# EAGLE design toyotune_usb (EAGLE 5.11)

## Sheet 1 of 2
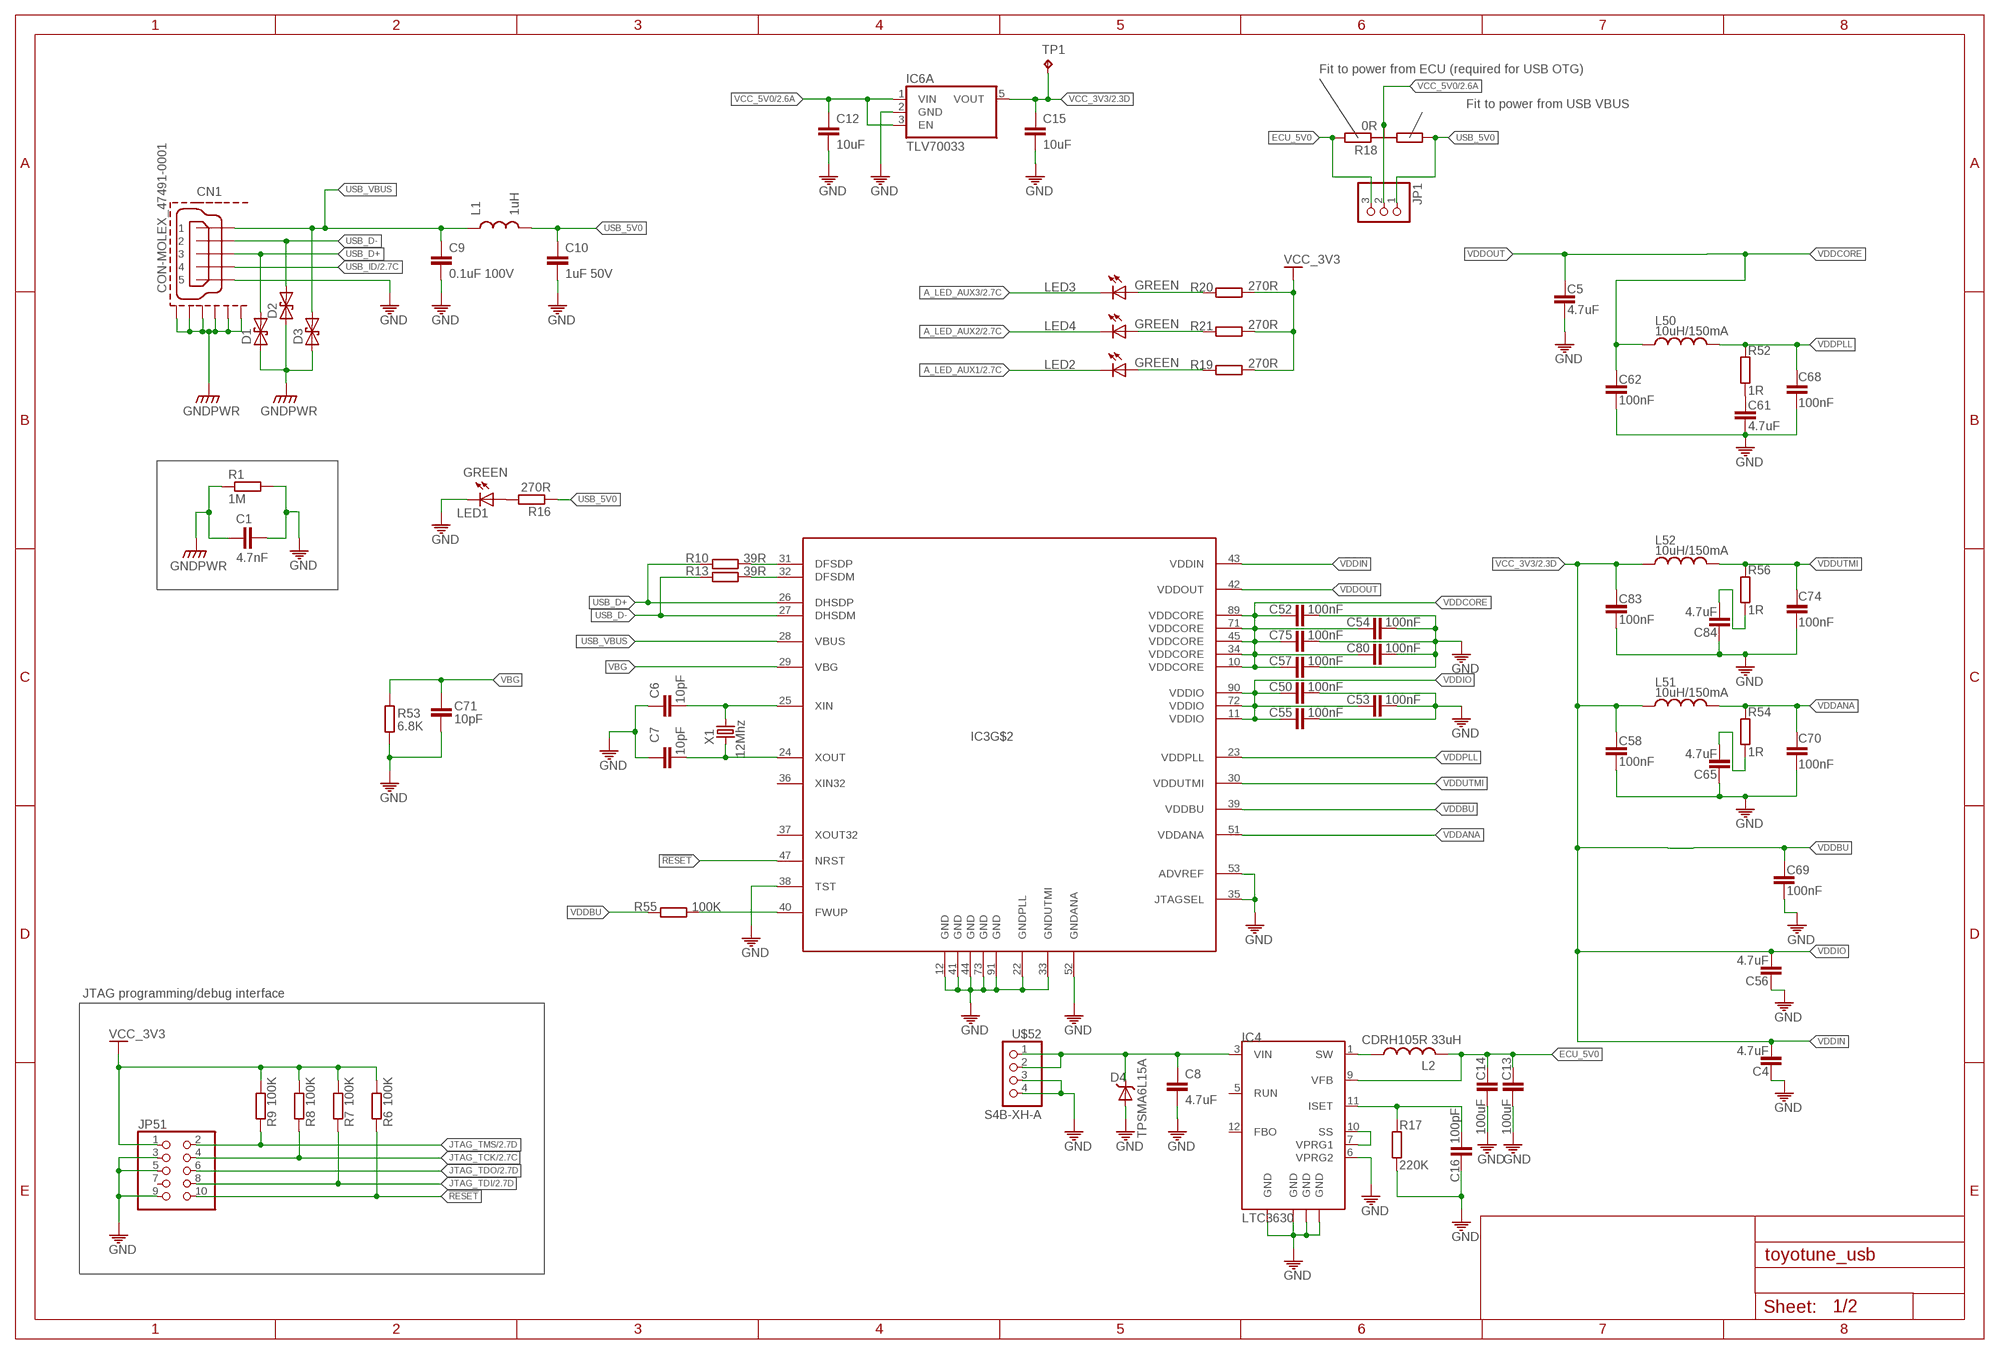
[diagram p0: schematic, sheet 1]

### Parts
C1  4.7nF  C-EUC0603  [C0603]
C4  4.7uF  C-EUC0805  [C0805]
C5  4.7uF  C-EUC0805  [C0805]
C6  10pF  C-EUC0603  [C0603]
C7  10pF  C-EUC0603  [C0603]
C8  4.7uF  C-EUC2220K  [C2220K]
C9  0.1uF 100V  C-EUC0603  [C0603]
C10  1uF 50V  C-EUC0603  [C0603]
C12  10uF  C-EUC0603  [C0603]
C13  100uF  C-EUC1210  [C1210]
C14  100uF  C-EUC1210  [C1210]
C15  10uF  C-EUC0603  [C0603]
C16  100pF  C-EUC0603  [C0603]
C50  100nF  C-EUC0603  [C0603]
C52  100nF  C-EUC0603  [C0603]
C53  100nF  C-EUC0603  [C0603]
C54  100nF  C-EUC0603  [C0603]
C55  100nF  C-EUC0603  [C0603]
C56  4.7uF  C-EUC0805  [C0805]
C57  100nF  C-EUC0603  [C0603]
C58  100nF  C-EUC0603  [C0603]
C61  4.7uF  C-EUC0805  [C0805]
C62  100nF  C-EUC0603  [C0603]
C65  4.7uF  C-EUC0805  [C0805]
C68  100nF  C-EUC0603  [C0603]
C69  100nF  C-EUC0603  [C0603]
C70  100nF  C-EUC0603  [C0603]
C71  10pF  C-EUC0603  [C0603]
C74  100nF  C-EUC0603  [C0603]
C75  100nF  C-EUC0603  [C0603]
C80  100nF  C-EUC0603  [C0603]
C83  100nF  C-EUC0603  [C0603]
C84  4.7uF  C-EUC0805  [C0805]
CN1  CON-MOLEX_47491-0001  [CON-MOLEX_47491-0001]
D1  PGB1010603  [R0603]
D2  PGB1010603  [R0603]
D3  PGB1010603  [R0603]
D4  TPSMA6L15A  TPSMA6L  [DO-221AC]
IC3  ATSAM3X4C  [LQFP100]
IC4  LTC3630  [MSE16]
IC6A  TLV70033  [DDC_R-PDSO-G5]
JP1  PINHD-1X3  [1X03]
JP51  PINHD-2X5/90  [2X05/90]
L1  1uH  INDUCTOR0603  [0603]
L2  CDRH105R 33uH  CDRH105R  [CDRH105R]
L50  10uH/150mA  NLFV25  [NLFV25]
L51  10uH/150mA  NLFV25  [NLFV25]
L52  10uH/150mA  NLFV25  [NLFV25]
LED1  GREEN  LEDCHIP-LED0603  [CHIP-LED0603]
LED2  GREEN  LEDCHIP-LED0603  [CHIP-LED0603]
LED3  GREEN  LEDCHIP-LED0603  [CHIP-LED0603]
LED4  GREEN  LEDCHIP-LED0603  [CHIP-LED0603]
R1  1M  R-EU_R0603  [R0603]
R6  100K  R-EU_R0603  [R0603]
R7  100K  R-EU_R0603  [R0603]
R8  100K  R-EU_R0603  [R0603]
R9  100K  R-EU_R0603  [R0603]
R10  39R  R-EU_R0603  [R0603]
R11  0R  NET_JOIN  [NET_JOIN]
R12  0R  NET_JOIN  [NET_JOIN]
R13  39R  R-EU_R0603  [R0603]
R14  0R  NET_JOIN  [NET_JOIN]
R16  270R  R-EU_R0603  [R0603]
R17  220K  R-EU_R0603  [R0603]
R18  0R  R-EU_D  [R0603-D]
R19  270R  R-EU_R0603  [R0603]
R20  270R  R-EU_R0603  [R0603]
R21  270R  R-EU_R0603  [R0603]
R51  0R  NET_JOIN  [NET_JOIN]
R52  1R  R-EU_R0603  [R0603]
R53  6.8K  R-EU_R0603  [R0603]
R54  1R  R-EU_R0603  [R0603]
R55  100K  R-EU_R0603  [R0603]
R56  1R  R-EU_R0603  [R0603]
TP1  TPPAD1-13  [P1-13]
U$52  S4B-XH-A  [JST-4]
X1  12Mhz  CRYSTAL5X3  [CRYSTAL-SMD-5X3]

### Nets
!RESET: IC3.47(NRST) JP51.10 R6.2
A_LED_AUX1: LED2.C ; also sheet 2
A_LED_AUX2: LED4.C ; also sheet 2
A_LED_AUX3: LED3.C ; also sheet 2
ECU_5V0: C13.1 C14.1 IC4.9(VFB) JP1.3 L2.2 R18.2
FWUP: IC3.40(FWUP) R55.1
GND: C1.2 C4.2 C5.1 C6.2 C7.2 C8.2 C9.2 C10.2 C12.2 C13.2 C14.2 C15.2 C16.1 C50.2 C52.2 C53.2 C54.2 C55.2 C56.2 C57.2 C58.1 C61.1 C62.1 C65.2 C68.1 C69.1 C70.1 C71.2 C74.1 C75.2 C80.2 C83.1 C84.2 CN1.5 D4.A IC3.12(GND) IC3.22(GNDPLL) IC3.33(GNDUTMI) IC3.35(JTAGSEL) IC3.38(TST) IC3.41(GND) IC3.44(GND) IC3.52(GNDANA) IC3.53(ADVREF) IC3.73(GND) IC3.91(GND) IC4.6(VPRG2) IC4.8(GND) IC4.14(GND) IC4.16(GND) IC4.17(GND) IC6A.2(GND) JP51.3 JP51.5 JP51.9 LED1.C R1.2 R17.2 R53.2 U$52.3 U$52.4 ; also sheet 2
GNDPWER: C1.1 CN1.GND@1(GND1) CN1.GND@2(GND2) CN1.GND@3(GND3) CN1.GND@4(GND4) CN1.GND@5(GND5) CN1.GND@6(GND6) D1.1 D2.1 D3.1 R1.1 ; supply symbol labelled GNDPWR
JTAG_TCK: JP51.4 R8.2 ; also sheet 2
JTAG_TDI: JP51.8 R7.2 ; also sheet 2
JTAG_TDO: JP51.6 ; also sheet 2
JTAG_TMS: JP51.2 R9.2 ; also sheet 2
N$1: IC4.7(VPRG1) IC4.10(SS)
N$2: LED1.A R16.2
N$3: IC3.32(DFSDM) R13.1
N$4: IC3.31(DFSDP) R10.1
N$8: LED3.A R20.2
N$9: LED4.A R21.2
N$13: IC4.1(SW) L2.1
N$14: LED2.A R19.2
N$17: C16.2 IC4.11(ISET) R17.1
N$18: C84.1 R56.2
N$19: C61.2 R52.2
N$20: C65.1 R54.2
USB_5V0: C10.1 JP1.1 L1.2 R16.1 R18.3
USB_D+: CN1.3 D1.2 IC3.26(DHSDP) R10.2
USB_D-: CN1.2 D2.2 IC3.27(DHSDM) R13.2
USB_ID: CN1.4 ; also sheet 2
USB_VBUS: C9.1 CN1.1 D3.2 IC3.28(VBUS) L1.1
VBG: C71.1 IC3.29(VBG) R53.1
VCC_3V3: C15.1 C58.2 C83.2 IC6A.5(VOUT) JP51.1 L51.1 L52.1 R6.1 R7.1 R8.1 R9.1 R11.P$1 R12.P$1 R19.1 R20.1 R21.1 R51.P$1 TP1.TP ; also sheet 2
VCC_5V0: C12.1 IC6A.1(VIN) IC6A.3(EN) JP1.2 R18.1 ; also sheet 2
VDDANA: C70.2 IC3.51(VDDANA) L51.2 R54.1
VDDBU: C69.2 IC3.39(VDDBU) R11.P$2 R55.2
VDDCORE: C52.1 C54.1 C57.1 C62.2 C75.1 C80.1 IC3.10(VDDCORE) IC3.34(VDDCORE) IC3.45(VDDCORE) IC3.71(VDDCORE) IC3.89(VDDCORE) L50.1 R14.P$2
VDDIN: C4.1 IC3.43(VDDIN) R12.P$2
VDDIO: C50.1 C53.1 C55.1 C56.1 IC3.11(VDDIO) IC3.72(VDDIO) IC3.90(VDDIO) R51.P$2
VDDOUT: C5.2 IC3.42(VDDOUT) R14.P$1
VDDPLL: C68.2 IC3.23(VDDPLL) L50.2 R52.1
VDDUTMI: C74.2 IC3.30(VDDUTMI) L52.2 R56.1
VIN: C8.1 D4.C IC4.3(VIN) U$52.1 U$52.2
XIN: C7.1 IC3.24(XOUT) X1.3
XOUT: C6.1 IC3.25(XIN) X1.1
Unconnected: IC3.36(XIN32) IC3.37(XOUT32) IC4.5(RUN) IC4.12(FBO) JP51.7

### Notes on the sheet
- Fit to power from ECU (required for USB OTG)
- Fit to power from USB VBUS
- JTAG programming/debug interface

## Sheet 2 of 2
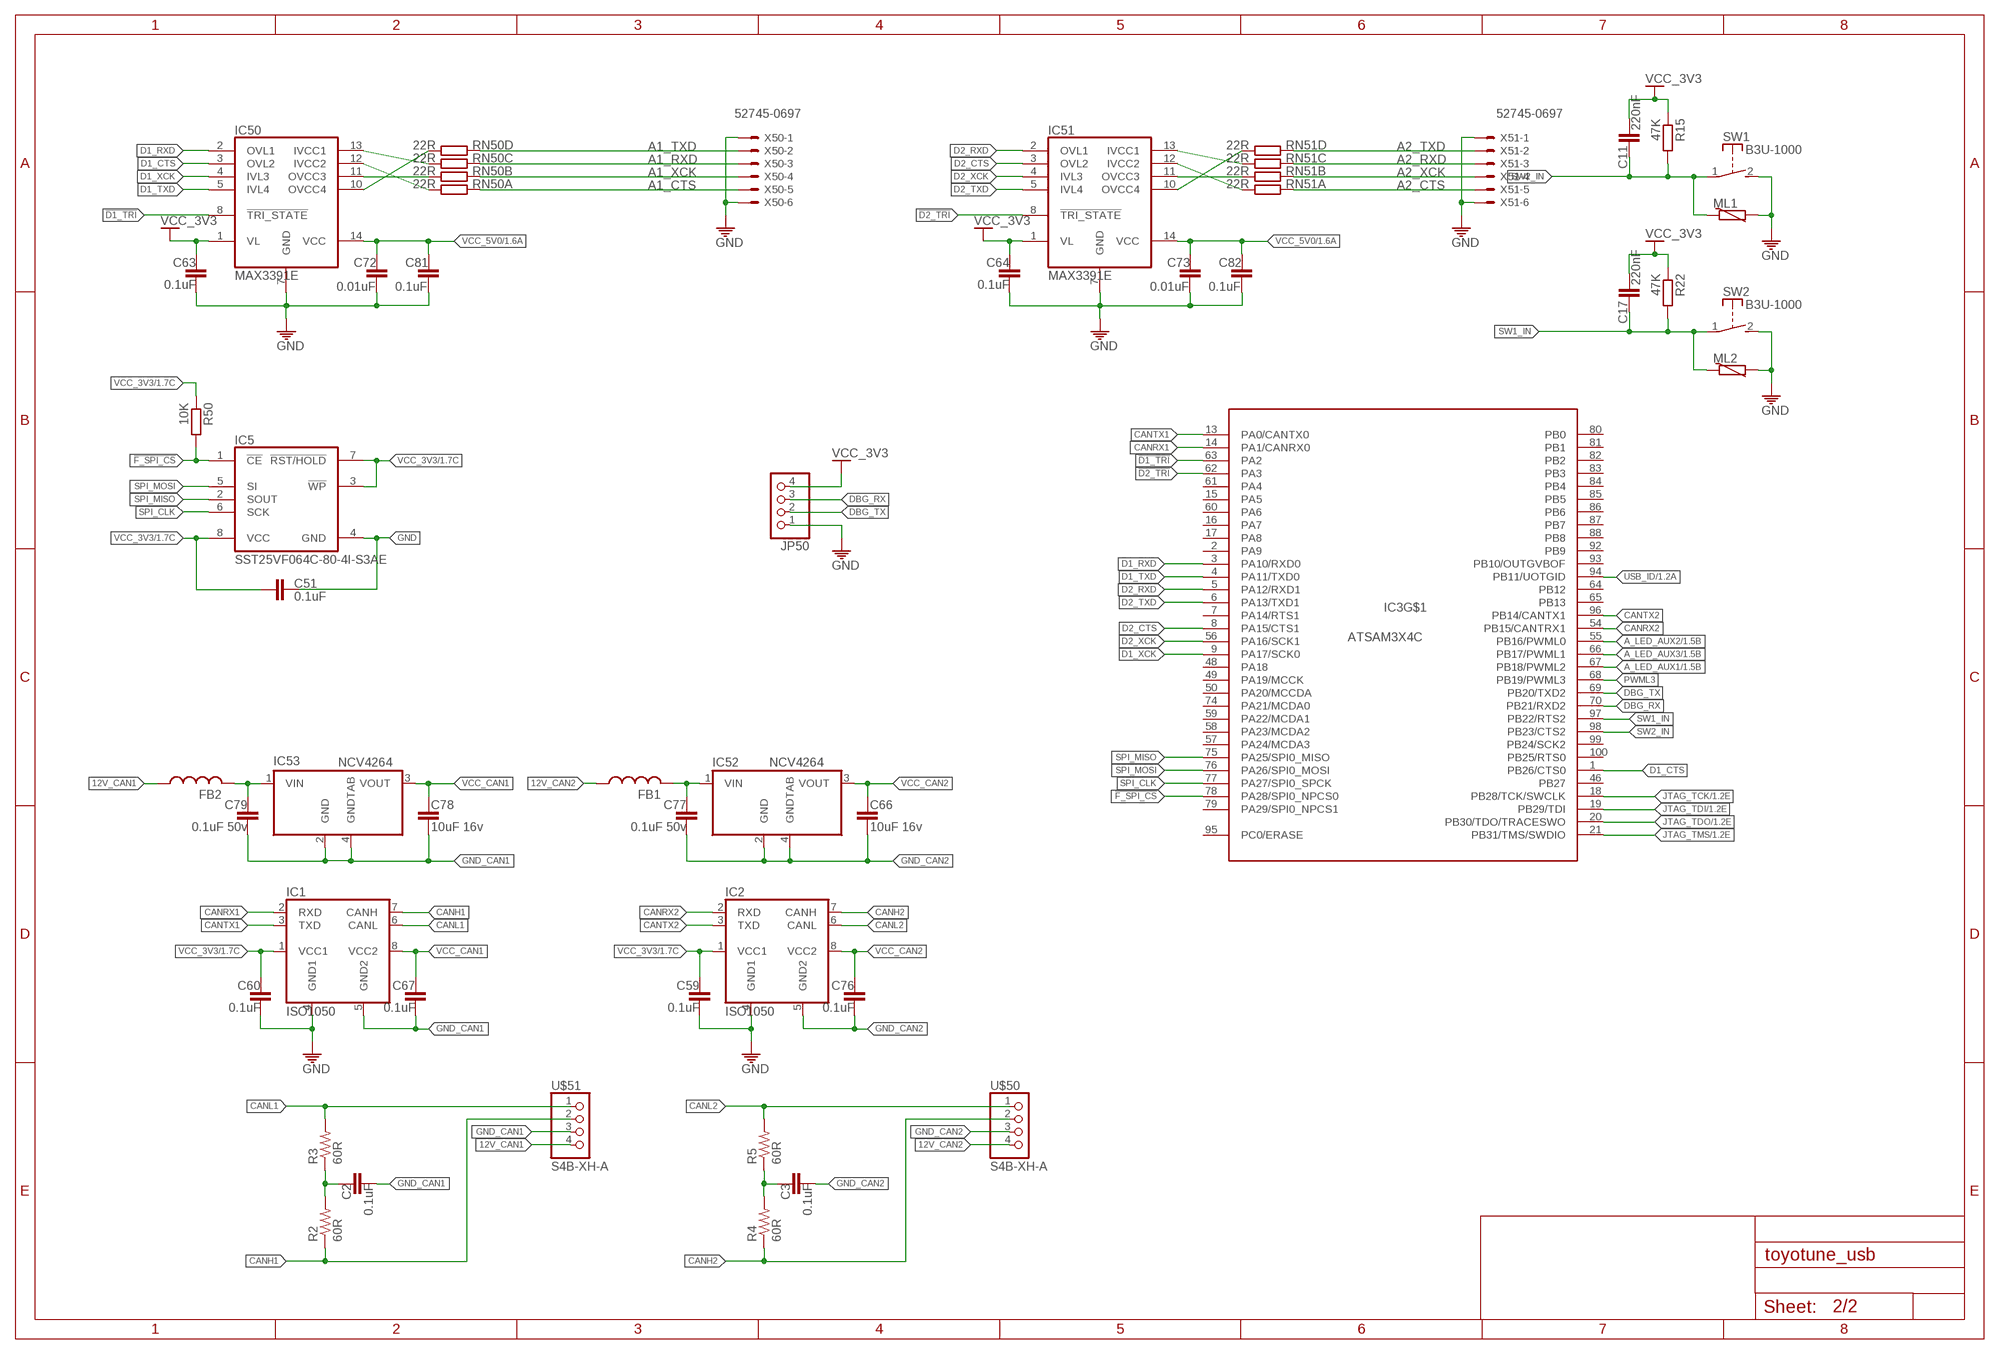
[diagram p1: schematic, sheet 2]

### Parts
C2  0.1uF  C-EUC0603  [C0603]
C3  0.1uF  C-EUC0603  [C0603]
C11  220nF  C-EUC0603  [C0603]
C17  220nF  C-EUC0603  [C0603]
C51  0.1uF  C-EUC0603  [C0603]
C59  0.1uF  C-EUC0603  [C0603]
C60  0.1uF  C-EUC0603  [C0603]
C63  0.1uF  C-EUC0603  [C0603]
C64  0.1uF  C-EUC0603  [C0603]
C66  10uF 16v  C-EUC0603  [C0603]
C67  0.1uF  C-EUC0603  [C0603]
C72  0.01uF  C-EUC0603  [C0603]
C73  0.01uF  C-EUC0603  [C0603]
C76  0.1uF  C-EUC0603  [C0603]
C77  0.1uF 50v  C-EUC0603  [C0603]
C78  10uF 16v  C-EUC0603  [C0603]
C79  0.1uF 50v  C-EUC0603  [C0603]
C81  0.1uF  C-EUC0603  [C0603]
C82  0.1uF  C-EUC0603  [C0603]
FB1  MI0805K400R  [R0805]
FB2  MI0805K400R  [R0805]
IC1  ISO1050  [DUB_R-PDSO-G8]
IC2  ISO1050  [DUB_R-PDSO-G8]
IC5  SST25VF064C-80-4I-S3AE  [SOIC8-200]
IC50  MAX3391E  [TSSOP14]
IC51  MAX3391E  [TSSOP14]
IC52  NCV4264  [SOT223-R]
IC53  NCV4264  [SOT223-R]
JP50  PINHD-1X4  [1X04]
ML1  V5.5MLA0603NH  [R0603]
ML2  V5.5MLA0603NH  [R0603]
R2  60R  R-US_MELF0207R  [MINI_MELF-0207R]
R3  60R  R-US_MELF0207R  [MINI_MELF-0207R]
R4  60R  R-US_MELF0207R  [MINI_MELF-0207R]
R5  60R  R-US_MELF0207R  [MINI_MELF-0207R]
R15  47K  R-EU_R0603  [R0603]
R22  47K  R-EU_R0603  [R0603]
R50  10K  R-EU_R0603  [R0603]
RN50  22R  CAT16-J4  [CAT16-J4]
RN51  22R  CAT16-J4  [CAT16-J4]
SW1  B3U-1000  [B3U-1000]
SW2  B3U-1000  [B3U-1000]
U$50  S4B-XH-A  [JST-4]
U$51  S4B-XH-A  [JST-4]
X50  52745-0697  [52745-0690]
X51  52745-0697  [52745-0690]

### Nets
12V_CAN1: FB2.1 U$51.4
12V_CAN2: FB1.1 U$50.4
!D1_TRI: IC3.63(PA2) IC50.8(!TRI_STATE)
!D2_TRI: IC3.62(PA3) IC51.8(!TRI_STATE)
!F_SPI_CS: IC3.78(PA28/SPI0_NPCS0) IC5.1(!CE) R50.2
A1_CTS: RN50.8 X50.5
A1_RXD: RN50.6 X50.3
A1_TXD: RN50.5 X50.2
A1_XCK: RN50.7 X50.4
A2_CTS: RN51.8 X51.5
A2_RXD: RN51.6 X51.3
A2_TXD: RN51.5 X51.2
A2_XCK: RN51.7 X51.4
A_LED_AUX1: IC3.67(PB18/PWML2) ; also sheet 1
A_LED_AUX2: IC3.55(PB16/PWML0) ; also sheet 1
A_LED_AUX3: IC3.66(PB17/PWML1) ; also sheet 1
CANH1: IC1.7(CANH) R2.1 U$51.2
CANH2: IC2.7(CANH) R4.1 U$50.2
CANL1: IC1.6(CANL) R3.2 U$51.1
CANL2: IC2.6(CANL) R5.2 U$50.1
CANRX1: IC1.2(RXD) IC3.14(PA1/CANRX0)
CANRX2: IC2.2(RXD) IC3.54(PB15/CANTRX1)
CANTX1: IC1.3(TXD) IC3.13(PA0/CANTX0)
CANTX2: IC2.3(TXD) IC3.96(PB14/CANTX1)
D1_CTS: IC3.1(PB26/CTS0) IC50.3(OVL2)
D1_RXD: IC3.3(PA10/RXD0) IC50.2(OVL1)
D1_TXD: IC3.4(PA11/TXD0) IC50.5(IVL4)
D1_XCK: IC3.9(PA17/SCK0) IC50.4(IVL3)
D2_CTS: IC3.8(PA15/CTS1) IC51.3(OVL2)
D2_RXD: IC3.5(PA12/RXD1) IC51.2(OVL1)
D2_TXD: IC3.6(PA13/TXD1) IC51.5(IVL4)
D2_XCK: IC3.56(PA16/SCK1) IC51.4(IVL3)
DBG_RX: IC3.70(PB21/RXD2) JP50.3
DBG_TX: IC3.69(PB20/TXD2) JP50.2
GND: C51.2 C59.1 C60.1 C63.1 C64.1 C72.1 C73.1 C81.1 C82.1 IC1.4(GND1) IC2.4(GND1) IC5.4(GND) IC50.7(GND) IC51.7(GND) JP50.1 ML1.2 ML2.2 SW1.2(S) SW2.2(S) X50.1 X50.6 X51.1 X51.6 ; also sheet 1
GND_CAN1: C2.1 C67.1 C78.1 C79.1 IC1.5(GND2) IC53.2(GND) IC53.4(GNDTAB) U$51.3
GND_CAN2: C3.1 C66.1 C76.1 C77.1 IC2.5(GND2) IC52.2(GND) IC52.4(GNDTAB) U$50.3
JTAG_TCK: IC3.18(PB28/TCK/SWCLK) ; also sheet 1
JTAG_TDI: IC3.19(PB29/TDI) ; also sheet 1
JTAG_TDO: IC3.20(PB30/TDO/TRACESWO) ; also sheet 1
JTAG_TMS: IC3.21(PB31/TMS/SWDIO) ; also sheet 1
N$5: IC50.13(IVCC1) RN50.3
N$6: IC51.13(IVCC1) RN51.3
N$7: IC51.12(IVCC2) RN51.1
N$10: IC50.12(IVCC2) RN50.1
N$11: IC51.10(OVCC4) RN51.4
N$12: IC50.11(OVCC3) RN50.2
N$15: IC50.10(OVCC4) RN50.4
N$16: IC51.11(OVCC3) RN51.2
N$23: C3.2 R4.2 R5.1
N$30: C2.2 R2.2 R3.1
N$55: C79.2 FB2.2 IC53.1(VIN)
N$90: C77.2 FB1.2 IC52.1(VIN)
PWML3: IC3.68(PB19/PWML3)
SPI_CLK: IC3.77(PA27/SPI0_SPCK) IC5.6(SCK)
SPI_MISO: IC3.75(PA25/SPI0_MISO) IC5.2(SOUT)
SPI_MOSI: IC3.76(PA26/SPI0_MOSI) IC5.5(SI)
SW1_IN: C17.2 IC3.97(PB22/RTS2) ML2.1 R22.2 SW2.1(P)
SW2_IN: C11.2 IC3.98(PB23/CTS2) ML1.1 R15.2 SW1.1(P)
USB_ID: IC3.94(PB11/UOTGID) ; also sheet 1
VCC_3V3: C11.1 C17.1 C51.1 C59.2 C60.2 C63.2 C64.2 IC1.1(VCC1) IC2.1(VCC1) IC5.3(!WP) IC5.7(!RST/HOLD) IC5.8(VCC) IC50.1(VL) IC51.1(VL) JP50.4 R15.1 R22.1 R50.1 ; also sheet 1
VCC_5V0: C72.2 C73.2 C81.2 C82.2 IC50.14(VCC) IC51.14(VCC) ; also sheet 1
VCC_CAN1: C67.2 C78.2 IC1.8(VCC2) IC53.3(VOUT)
VCC_CAN2: C66.2 C76.2 IC2.8(VCC2) IC52.3(VOUT)
Unconnected: IC3.2(PA9) IC3.7(PA14/RTS1) IC3.15(PA5) IC3.16(PA7) IC3.17(PA8) IC3.46(PB27) IC3.48(PA18) IC3.49(PA19/MCCK) IC3.50(PA20/MCCDA) IC3.57(PA24/MCDA3) IC3.58(PA23/MCDA2) IC3.59(PA22/MCDA1) IC3.60(PA6) IC3.61(PA4) IC3.64(PB12) IC3.65(PB13) IC3.74(PA21/MCDA0) IC3.79(PA29/SPI0_NPCS1) IC3.80(PB0) IC3.81(PB1) IC3.82(PB2) IC3.83(PB3) IC3.84(PB4) IC3.85(PB5) IC3.86(PB6) IC3.87(PB7) IC3.88(PB8) IC3.92(PB9) IC3.93(PB10/OUTGVBOF) IC3.95(PC0/ERASE) IC3.99(PB24/SCK2) IC3.100(PB25/RTS0)

## Library data of the parts
C1-C3 C6 C7 C11 C16 C17 C50-C55 C57-C60 C62-C64 C66-C83 = rcl:C-EU: CAPACITOR, European symbol
C4 C5 C8-C10 C12-C15 C56 C61 C65 C84 = toyotune:C-EU: CAPACITOR, European symbol
CN1 = toyotune:CON-MOLEX_47491-0001
D1-D3 = toyotune:PGB1010603
D4 = toyotune:TPSMA6L
FB1 FB2 = toyotune:MI0805K400R
IC1 IC2 = toyotune:ISO1050
IC3 = toyotune:ATSAM3X4C
IC4 = toyotune:LTC3630
IC5 = toyotune:SST25VF064C-80-4I
IC6A = toyotune:TLV70033
IC50 IC51 = toyotune:MAX3391E
IC52 IC53 = toyotune:NCV4264
JP1 = pinhead:PINHD-1X3: PIN HEADER
JP50 = toyotune:PINHD-1X4: PIN HEADER
JP51 = toyotune:PINHD-2X5: PIN HEADER
L1 = toyotune:INDUCTOR: Inductors Basic Inductor/Choke - 0603 and 1206. Footprints are not proven and vary greatly between part numbers.
L2 = toyotune:CDRH105R
L50-L52 = toyotune:NLFV25
LED1 = led:LED: LED OSRAM: - CHIPLED LG R971, LG N971, LY N971, LG Q971, LY Q971, LO R971, LY R971 LH N974, LH R974 LS Q976, LO Q976, LY Q976 LO Q996 - Hyper CHIPLED LW Q18S LB Q993, LB Q99A, LB R99A - SideLED LS A670, LO A670, LY A670, LG A670, LP A670 LB A673, LV A673, LT A673, LW A673 LH A674 LY A675 LS A676, LA A676, LO A676, LY A676, LW A676 LS A679, LY A679, LG A679 - Hyper Micro SIDELED® LS Y876, LA Y876, LO Y876, LY Y876 LT Y87S - SmartLED LW L88C, LW L88S LB L89C, LB L89S, LG L890 LS L89K, LO L89K, LY L89K LS L896, LA L896, LO L896, LY L896 - TOPLED LS T670, LO T670, LY T670, LG T670, LP T670 LSG T670, LSP T670, LSY T670, LOP T670, LYG T670 LG T671, LOG T671, LSG T671 LB T673, LV T673, LT T673, LW T673 LH T674 LS T676, LA T676, LO T676, LY T676, LB T676, LH T676, LSB T676, LW T676 LB T67C, LV T67C, LT T67C, LS T67K, LO T67K, LY T67K, LW E67C LS E67B, LA E67B, LO E67B, LY E67B, LB E67C, LV E67C, LT E67C LW T67C LS T679, LY T679, LG T679 LS T770, LO T770, LY T770, LG T770, LP T770 LB T773, LV T773, LT T773, LW T773 LH T774 LS E675, LA E675, LY E675, LS T675 LS T776, LA T776, LO T776, LY T776, LB T776 LHGB T686 LT T68C, LB T68C - Hyper Mini TOPLED® LB M676 - Mini TOPLED Santana® LG M470 LS M47K, LO M47K, LY M47K Source: http://www.osram.convergy.de LUXEON: - LUMILED® LXK2-PW12-R00, LXK2-PW12-S00, LXK2-PW14-U00, LXK2-PW14-V00 LXK2-PM12-R00, LXK2-PM12-S00, LXK2-PM14-U00 LXK2-PE12-Q00, LXK2-PE12-R00, LXK2-PE12-S00, LXK2-PE14-T00, LXK2-PE14-U00 LXK2-PB12-K00, LXK2-PB12-L00, LXK2-PB12-M00, LXK2-PB14-N00, LXK2-PB14-P00, LXK2-PB14-Q00 LXK2-PR12-L00, LXK2-PR12-M00, LXK2-PR14-Q00, LXK2-PR14-R00 LXK2-PD12-Q00, LXK2-PD12-R00, LXK2-PD12-S00 LXK2-PH12-R00, LXK2-PH12-S00 LXK2-PL12-P00, LXK2-PL12-Q00, LXK2-PL12-R00 Source: www.luxeon.com KINGBRIGHT: KA-3528ASYC Source: www.kingbright.com
LED2-LED4 = toyotune:LED: LED OSRAM: - CHIPLED LG R971, LG N971, LY N971, LG Q971, LY Q971, LO R971, LY R971 LH N974, LH R974 LS Q976, LO Q976, LY Q976 LO Q996 - Hyper CHIPLED LW Q18S LB Q993, LB Q99A, LB R99A - SideLED LS A670, LO A670, LY A670, LG A670, LP A670 LB A673, LV A673, LT A673, LW A673 LH A674 LY A675 LS A676, LA A676, LO A676, LY A676, LW A676 LS A679, LY A679, LG A679 - Hyper Micro SIDELED® LS Y876, LA Y876, LO Y876, LY Y876 LT Y87S - SmartLED LW L88C, LW L88S LB L89C, LB L89S, LG L890 LS L89K, LO L89K, LY L89K LS L896, LA L896, LO L896, LY L896 - TOPLED LS T670, LO T670, LY T670, LG T670, LP T670 LSG T670, LSP T670, LSY T670, LOP T670, LYG T670 LG T671, LOG T671, LSG T671 LB T673, LV T673, LT T673, LW T673 LH T674 LS T676, LA T676, LO T676, LY T676, LB T676, LH T676, LSB T676, LW T676 LB T67C, LV T67C, LT T67C, LS T67K, LO T67K, LY T67K, LW E67C LS E67B, LA E67B, LO E67B, LY E67B, LB E67C, LV E67C, LT E67C LW T67C LS T679, LY T679, LG T679 LS T770, LO T770, LY T770, LG T770, LP T770 LB T773, LV T773, LT T773, LW T773 LH T774 LS E675, LA E675, LY E675, LS T675 LS T776, LA T776, LO T776, LY T776, LB T776 LHGB T686 LT T68C, LB T68C - Hyper Mini TOPLED® LB M676 - Mini TOPLED Santana® LG M470 LS M47K, LO M47K, LY M47K Source: http://www.osram.convergy.de LUXEON: - LUMILED® LXK2-PW12-R00, LXK2-PW12-S00, LXK2-PW14-U00, LXK2-PW14-V00 LXK2-PM12-R00, LXK2-PM12-S00, LXK2-PM14-U00 LXK2-PE12-Q00, LXK2-PE12-R00, LXK2-PE12-S00, LXK2-PE14-T00, LXK2-PE14-U00 LXK2-PB12-K00, LXK2-PB12-L00, LXK2-PB12-M00, LXK2-PB14-N00, LXK2-PB14-P00, LXK2-PB14-Q00 LXK2-PR12-L00, LXK2-PR12-M00, LXK2-PR14-Q00, LXK2-PR14-R00 LXK2-PD12-Q00, LXK2-PD12-R00, LXK2-PD12-S00 LXK2-PH12-R00, LXK2-PH12-S00 LXK2-PL12-P00, LXK2-PL12-Q00, LXK2-PL12-R00 Source: www.luxeon.com KINGBRIGHT: KA-3528ASYC Source: www.kingbright.com
ML1 ML2 = toyotune:V5.5MLA0603NH
R1 R6-R10 R13 R15-R17 R19-R22 R50 R52-R56 = rcl:R-EU_: RESISTOR, European symbol
R2-R5 = rcl:R-US_: RESISTOR, American symbol
R11 R12 R14 R51 = toyotune:NET_JOIN
R18 = toyotune:R-EU_D
RN50 RN51 = toyotune:CAT16-J4
SW1 SW2 = toyotune:B3U-1000
TP1 = testpad:TP: Test pad
U$50-U$52 = toyotune:S4B-XH-A
X1 = toyotune:CRYSTAL: Crystals Various standard crystals. Proven footprints. Spark Fun Electronics SKU : COM-00534
X50 X51 = toyotune:52745-0697: FFC/FPC-to-Board 0.50mm (.020") SMT Top Contact Right Angle, ZIF, Style Receptacle 52745 / 52435 Source: http://www.molex.com/product/ffc/52745.html; MPN: 52745-0690; OC_FARNELL: unknown; OC_NEWARK: 92M6374

## Net classes
0 default: width 0.152 mm, drill 0.33 mm, clearance 0.152 mm
1 power: width 0.01 mm, clearance 0.229 mm
2 usb: width 0.457 mm, drill 0.457 mm, clearance 0.152 mm

## Board
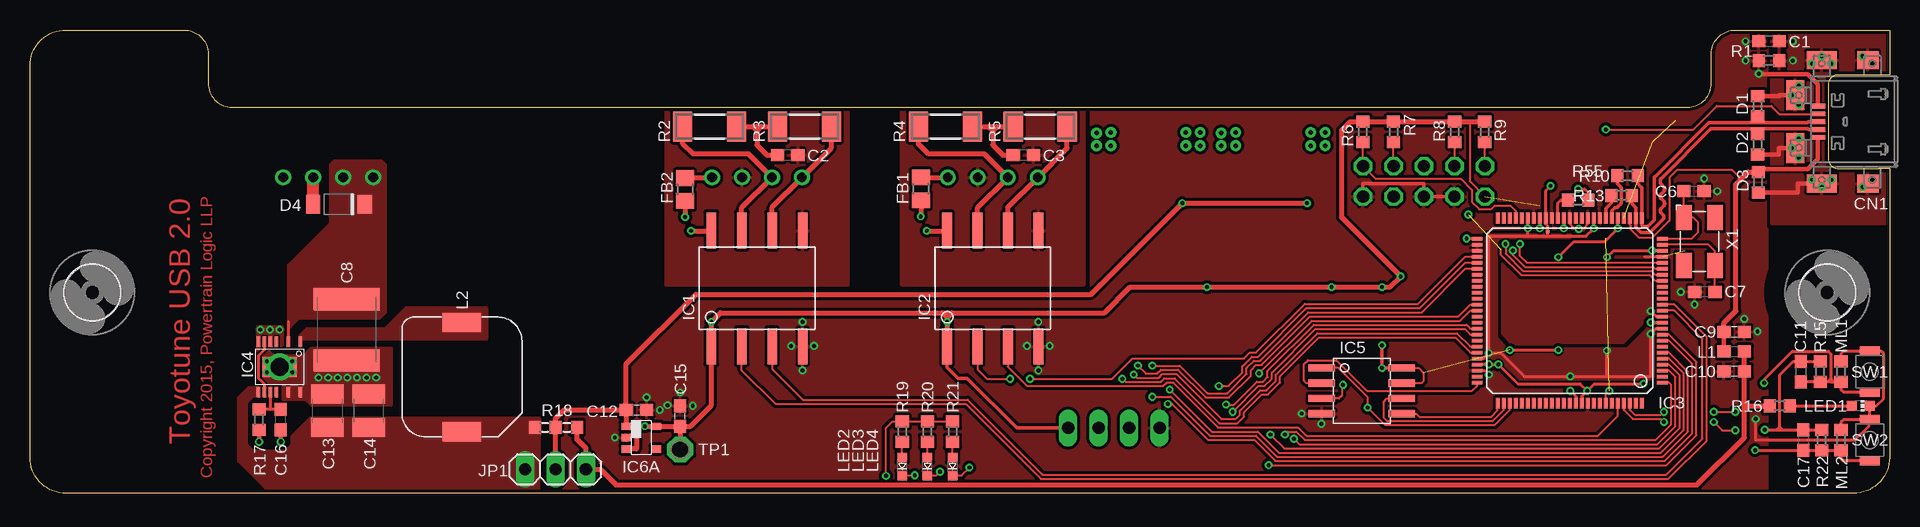
[diagram p2: board, top side]
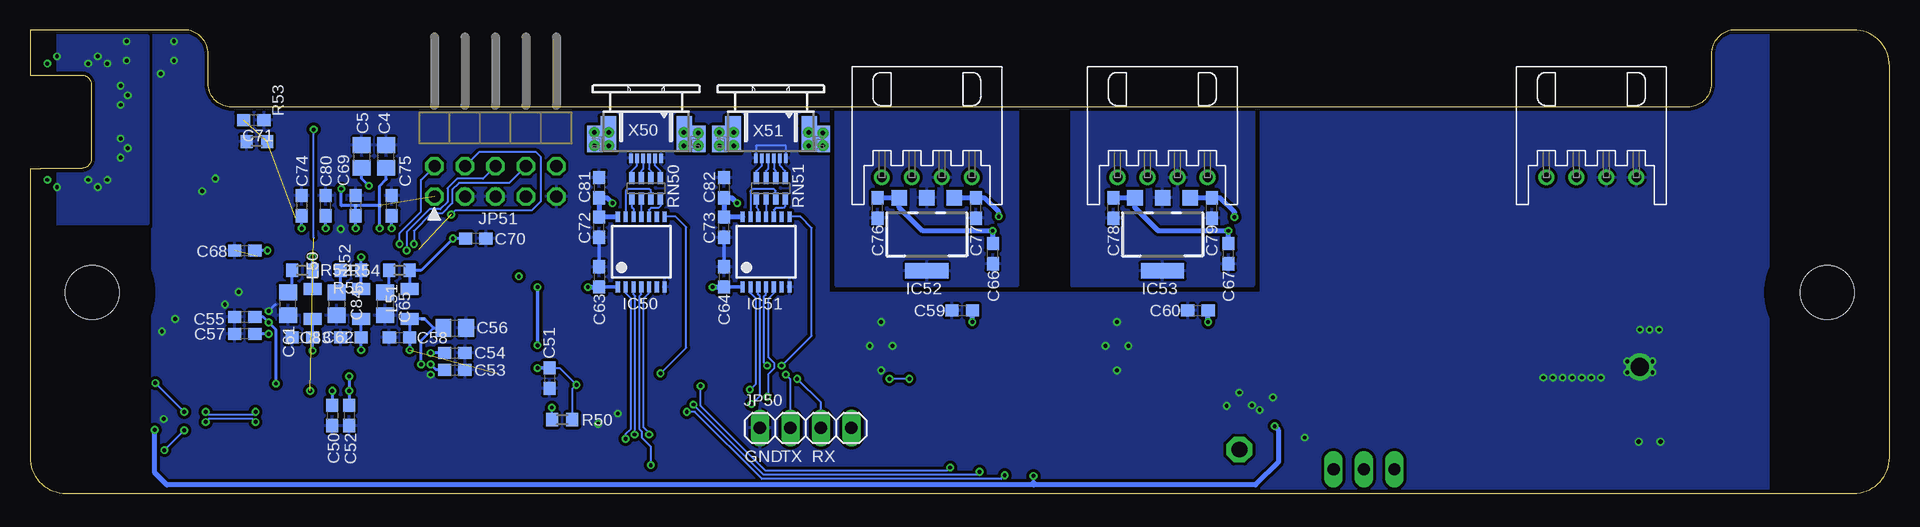
[diagram p3: board, bottom side, seen from below]

Size 155 x 38.65 mm. Coordinates in mm from the lower left corner, seen from the top.
Outline: 154.05,34.9 155,34.9 155,38.65 142.15,38.65 arc90 140.15,36.65 140.15,34.2 arc-90 138.15,32.2 16.85,32.2 arc-90 14.85,34.2 14.85,36.65 arc90 12.85,38.65 3,38.65 arc90 0,35.65 0,3 arc90 3,0 152,0 arc90 155,3 155,27.1 154.1,27.1
Copper layers (1*16): Top 0.035mm / dielectric 1.5mm / Bottom 0.035mm
Design rules "elecrow *": minimum track width 6mil, minimum drill 12mil, track to track 6mil, track to pad 6mil, pad to pad 6mil, via to via 6mil, smd to smd 0mil, copper to edge 10mil, drill to drill 10mil, minimum pad ring 10mil, minimum via ring 6mil, stop-mask expansion 2mil, vias tented up to drill 100mil, thermal gap 8mil
bRestrict: area 152.8,-0.1 to 154.8,40.1

### Footprints (pad centres in the part's own frame; a part is rotated, then mirrored left to right if it is on the bottom)
C0603 = smd 1.1 x 1: 1 -0.85,0; 2 0.85,0
C0805 = smd 1.3 x 1.5: 1 -0.95,0; 2 0.95,0
C2220K = smd 1.85 x 5.5: 1 -2.55,0; 2 2.55,0
C1210 = smd 1.6 x 2.7: 1 -1.4,0; 2 1.4,0
CON-MOLEX_47491-0001 = smd 1.25 x 0.4: 1 2.475,1.3; 2 2.475,0.65; 3 2.475,0; 4 2.475,-0.65; 5 2.475,-1.3 | smd 1.8 x 1.5: GND@1 -1.7,5.15; GND@6 -1.7,-5.15 | smd 2.5 x 1.5: GND@2 2.15,5.15; GND@5 2.15,-5.15 | smd 1.5 x 2.5: GND@3 4.35,2.2; GND@4 4.35,-2.2
R0603 = smd 1 x 1.1: 1 -0.85,0; 2 0.85,0
DO-221AC = smd 1.2 x 1.52: A -2.15,0; C 2.15,0
4.5 = hole 4.5: 0,0
R0805 = smd 1.3 x 1.5: 1 -0.95,0; 2 0.95,0
DUB_R-PDSO-G8 = smd 0.8 x 3: 1 -3.81,-4.826; 2 -1.27,-4.826; 3 1.27,-4.826; 4 3.81,-4.826; 5 3.81,4.826; 6 1.27,4.826; 7 -1.27,4.826; 8 -3.81,4.826
LQFP100 = smd 0.9 x 0.3: 1 -7.72,6; 2 -7.72,5.5; 3 -7.72,5; 4 -7.72,4.5; 5 -7.72,4; 6 -7.72,3.5; 7 -7.72,3; 8 -7.72,2.5; 9 -7.72,2; 10 -7.72,1.5; 11 -7.72,1; 12 -7.72,0.5; 13 -7.72,0; 14 -7.72,-0.5; 15 -7.72,-1; 16 -7.72,-1.5; 17 -7.72,-2; 18 -7.72,-2.5; 19 -7.72,-3; 20 -7.72,-3.5; 21 -7.72,-4; 22 -7.72,-4.5; 23 -7.72,-5; 24 -7.72,-5.5; 25 -7.72,-6; 51 7.72,-6; 52 7.72,-5.5; 53 7.72,-5; 54 7.72,-4.5; 55 7.72,-4; 56 7.72,-3.5; 57 7.72,-3; 58 7.72,-2.5; 59 7.72,-2; 60 7.72,-1.5; 61 7.72,-1; 62 7.72,-0.5; 63 7.72,0; 64 7.72,0.5; 65 7.72,1; 66 7.72,1.5; 67 7.72,2; 68 7.72,2.5; 69 7.72,3; 70 7.72,3.5; 71 7.72,4; 72 7.72,4.5; 73 7.72,5; 74 7.72,5.5; 75 7.72,6 | smd 0.3 x 0.9: 26 -6,-7.72; 27 -5.5,-7.72; 28 -5,-7.72; 29 -4.5,-7.72; 30 -4,-7.72; 31 -3.5,-7.72; 32 -3,-7.72; 33 -2.5,-7.72; 34 -2,-7.72; 35 -1.5,-7.72; 36 -1,-7.72; 37 -0.5,-7.72; 38 0,-7.72; 39 0.5,-7.72; 40 1,-7.72; 41 1.5,-7.72; 42 2,-7.72; 43 2.5,-7.72; 44 3,-7.72; 45 3.5,-7.72; 46 4,-7.72; 47 4.5,-7.72; 48 5,-7.72; 49 5.5,-7.72; 50 6,-7.72; 76 6,7.72; 77 5.5,7.72; 78 5,7.72; 79 4.5,7.72; 80 4,7.72; 81 3.5,7.72; 82 3,7.72; 83 2.5,7.72; 84 2,7.72; 85 1.5,7.72; 86 1,7.72; 87 0.5,7.72; 88 0,7.72; 89 -0.5,7.72; 90 -1,7.72; 91 -1.5,7.72; 92 -2,7.72; 93 -2.5,7.72; 94 -3,7.72; 95 -3.5,7.72; 96 -4,7.72; 97 -4.5,7.72; 98 -5,7.72; 99 -5.5,7.72; 100 -6,7.72
MSE16 = smd 0.305 x 0.89: 1 -1.75,-2.1; 3 -0.75,-2.1; 5 0.25,-2.1; 6 0.75,-2.1; 7 1.25,-2.1; 8 1.75,-2.1; 9 1.75,2.1; 10 1.25,2.1; 11 0.75,2.1; 12 0.25,2.1; 14 -0.75,2.1; 16 -1.75,2.1 | smd 2.845 x 1.651: 17 0,0
SOIC8-200 = smd 0.6 x 2.2: 1 -1.905,-3.175; 2 -0.635,-3.175; 3 0.635,-3.175; 4 1.905,-3.175; 5 1.905,3.493; 6 0.635,3.493; 7 -0.635,3.493; 8 -1.905,3.493
DDC_R-PDSO-G5 = smd 0.6 x 0.8: 1 -0.95,-1.25; 2 0,-1.25; 3 0.95,-1.25; 4 0.95,1.25; 5 -0.95,1.25
TSSOP14 = smd 0.35 x 0.9: 1 -1.95,-2.925; 2 -1.3,-2.925; 3 -0.65,-2.925; 4 0,-2.925; 5 0.65,-2.925; 6 1.3,-2.925; 7 1.95,-2.925; 8 1.95,2.925; 9 1.3,2.925; 10 0.65,2.925; 11 0,2.925; 12 -0.65,2.925; 13 -1.3,2.925; 14 -1.95,2.925
SOT223-R = smd 1.3 x 1.3: 1 -2.3,-3.05; 2 0,-3.05; 3 2.3,-3.05 | smd 3.6 x 1.3: 4 0,3.05
1X03 = drill 1.016 long: 1 -2.54,0; 2 0,0; 3 2.54,0
1X04 = drill 1.016 long: 1 -3.81,0; 2 -1.27,0; 3 1.27,0; 4 3.81,0
2X05/90 = drill 1.016 octagon: 1 -5.08,-6.35; 2 -5.08,-3.81; 3 -2.54,-6.35; 4 -2.54,-3.81; 5 0,-6.35; 6 0,-3.81; 7 2.54,-6.35; 8 2.54,-3.81; 9 5.08,-6.35; 10 5.08,-3.81
0603 = smd 1.1 x 1: 1 -0.85,0; 2 0.85,0
CDRH105R = smd 1.6 x 3.2: 1 -4.55,0; 2 4.55,0
NLFV25 = smd 1 x 1.5: 1 -1.25,0; 2 1.25,0
CHIP-LED0603 = smd 0.8 x 0.8: A 0,-0.75; C 0,0.75
MINI_MELF-0207R = smd 1.6 x 2.5: 1 -2.25,0; 2 2.25,0
NET_JOIN = smd 0.254 x 0.254: P$1 0,0; P$2 0,0
R0603-D = smd 1 x 1.1: 1 0.05,0; 2 1.75,0; 3 -1.75,0
CAT16-J4 = smd 0.45 x 1: 1 -1.2,-0.8; 2 -0.4,-0.8; 3 0.4,-0.8; 4 1.2,-0.8; 5 1.2,0.9; 6 0.4,0.9; 7 -0.4,0.9; 8 -1.2,0.9
B3U-1000 = smd 0.8 x 1.7: 1 -1.7,0; 2 1.7,0
P1-13 = drill 1.321 pad 2.159 octagon: TP 0,0
JST-4 = drill 0.8 round: 1 -3.75,0; 2 -1.25,0; 3 1.25,0; 4 3.75,0
CRYSTAL-SMD-5X3 = smd 2.1 x 1.3: 1 -2,-1.3; 2 2,-1.3; 3 2,1.3; 4 -2,1.3
52745-0690 = smd 0.3 x 0.8: 1 -1.25,2.5; 2 -0.75,2.5; 3 -0.25,2.5; 4 0.25,2.5; 5 0.75,2.5; 6 1.25,2.5 | smd 2.4 x 2.2: M$1 -3.75,0.9; M$3 3.7,0.9 | smd 1.3 x 0.8: M$2 -3.2,-0.6; M$4 3.15,-0.6 | drill 0.381 round: P$1 -3.15,0.35; P$2 -3.15,1.45; P$3 3.1,1.45; P$4 3.1,0.35; P$5 4.3,0.35; P$6 4.3,1.45; P$7 -4.35,1.45; P$8 -4.35,0.4

### Placement (x,y rotation side)
C1  144.95,37.7 180 top
C2  63.15,28.2 180 top
C3  82.8,28.2 180 top
C4  125.3,28.1 90 bottom
C5  127.35,28.1 270 bottom
C6  138.7,25.2 0 top
C7  139.6,16.8 180 top
C8  26.4,13.65 270 top
C9  142.05,13.48 0 top
C10  142.05,10.18 180 top
C11  147.6,10.15 270 top
C12  50.55,6.95 0 top
C13  24.8,6.9 90 top
C14  28.25,6.9 90 top
C15  54.2,6.45 90 top
C16  20.9,6.15 90 top
C17  147.8,4.45 270 top
C50  129.8,6.5 270 bottom
C51  111.7,9.6 270 bottom
C52  128.4,6.5 270 bottom
C53  119.6,10.3 0 bottom
C54  119.6,11.7 0 bottom
C55  137.1,14.7 180 bottom
C56  119.6,13.8 0 bottom
C57  137.1,13.3 180 bottom
C58  124.2,13 0 bottom
C59  77.3,15.25 0 bottom
C60  57.65,15.25 0 bottom
C61  133.5,15.8 90 bottom
C62  132.3,13 0 bottom
C63  107.55,18.05 270 bottom
C64  97.15,18.05 270 bottom
C65  125.4,15.8 270 bottom
C66  74.75,20 90 bottom
C67  55.1,20 90 bottom
C68  137.1,20.25 0 bottom
C69  127.85,24 270 bottom
C70  117.85,21.25 180 bottom
C71  136.35,31.15 0 bottom
C72  107.55,22.2 90 bottom
C73  97.15,22.2 90 bottom
C74  132.35,24 270 bottom
C75  124.85,24 90 bottom
C76  84.35,23.8 90 bottom
C77  76.15,23.8 90 bottom
C78  64.7,23.8 90 bottom
C79  56.5,23.8 90 bottom
C80  130.35,24 90 bottom
C81  107.55,25.5 270 bottom
C82  97.15,25.5 270 bottom
C83  128.25,13 0 bottom
C84  129.45,15.8 270 bottom
CN1  151.5,31 180 top
D1  144,32.3 270 top
D2  144,29.1 90 top
D3  144.05,25.95 90 top
D4  25.75,24.1 0 top
E$1  [4.5]  5.2,16.75 0 top
E$2  [4.5]  149.8,16.75 0 top
FB1  74.25,25.4 270 top
FB2  54.6,25.35 270 top
IC1  60.6,17.1 0 top
IC2  80.25,17.1 0 top
IC3  128.35,15.25 180 top
IC4  20.8,10.55 180 top
IC5  110.85,8.55 270 top
IC6A  50.95,4.65 270 top
IC50  104.05,20.15 0 bottom
IC51  93.65,20.15 0 bottom
IC52  80.25,21.6 180 bottom
IC53  60.6,21.6 180 bottom
JP1  43.8,2 180 top
JP50  90.35,5.45 0 bottom
JP51  116.2,31.1 0 bottom
L1  142.05,11.82 0 top
L2  36,9.7 270 top
L50  131.45,15.8 90 bottom
L51  123.35,15.8 90 bottom
L52  127.4,15.8 90 bottom
LED1  152.6,7.3 270 top
LED2  72.7,2.25 180 top
LED3  74.8,2.25 180 top
LED4  76.9,2.25 180 top
ML1  150.95,10.15 90 top
ML2  150.95,4.45 90 top
R1  144.95,36.1 180 top
R2  56.65,30.6 0 top
R3  64.55,30.6 0 top
R4  76.3,30.6 0 top
R5  84.2,30.6 0 top
R6  111.1,30.15 270 top
R7  113.65,30.15 270 top
R8  118.75,30.15 270 top
R9  121.25,30.15 270 top
R10  133.15,26.5 0 top
R11  127.85,24 270 bottom
R12  125.85,24 270 bottom
R13  132.65,24.85 0 top
R14  126.5,21.85 90 top
R15  149.22,10.15 270 top
R16  145.85,7.3 0 top
R17  19.1,6.15 270 top
R18  43.85,5.5 180 top
R19  72.7,5.15 270 top
R20  74.8,5.15 270 top
R21  76.9,5.15 270 top
R22  149.35,4.45 270 top
R50  110.65,6.15 180 bottom
R51  122.25,14.55 0 bottom
R52  132.3,18.6 180 bottom
R53  136.1,29.35 180 bottom
R54  124.2,18.6 180 bottom
R55  129.05,24.45 0 top
R56  128.25,18.6 180 bottom
RN50  103.65,25.4 0 bottom
RN51  93.25,25.4 0 bottom
SW1  153.35,10.15 90 top
SW2  153.35,4.45 90 top
TP1  54.2,3.65 270 top
U$50  80.25,26.35 0 bottom
U$51  60.6,26.35 0 bottom
U$52  24.85,26.35 0 bottom
X1  139.15,21 270 top
X50  103.65,30.45 180 bottom
X51  93.25,30.45 180 bottom

### Tracks (layer width: path | path; a pad name or v marks a point on that pad's centre or on a via)
12V_CAN1
  Top 0.406: U$51.4 54.65,26.35 FB2.1
12V_CAN2
  Top 0.406: FB1.1 U$50.4
!D1_TRI  (via drill 0.33)
  Top 0.178: IC3.63 120.05,15.25 119.2,14.4 106.85,14.4 v102.45,10
  Bottom 0.178: IC50.8 101.17,23.08 100.3,22.2 100.3,12.15 v102.45,10
!D2_TRI  (via drill 0.33)
  Top 0.178: IC3.62 120.05,15.75 119.05,14.75 106.7,14.75 102.65,10.7 102.2,10.7 101.75,10.25 101.75,9.8 99.95,8 98,8 95.7,10.3 94.25,10.3 93.95,10 93,10 v92.35,10.65
  Bottom 0.178: v92.35,10.65 89.85,13.15 89.85,22.15 90.78,23.08 IC51.8
!F_SPI_CS  (via drill 0.33)
  Top 0.178: IC3.78 123.35,6.95 122.1,5.7 112.95,5.7 v111.5,7.15 111.5,8 109.05,10.45 IC5.1
  Bottom 0.178: R50.2 v111.5,7.15
!RESET
  Top 0.178: R6.2 111.1,27.29 JP51.10 112.16,26.25 119.25,26.25 120.2,25.3 120.2,24.3 120.8,23.7 121.8,23.7 122.1,24 123.4,24 123.85,23.55 IC3.47
A1_CTS
  Bottom 0.178: X50.5 104.4,27.35 104.85,26.9 RN50.8
A1_RXD
  Bottom 0.178: RN50.6 103.25,26.9 103.4,27.05 X50.3
A1_TXD
  Bottom 0.178: X50.2 102.9,27.35 102.45,26.9 RN50.5
A1_XCK
  Bottom 0.178: RN50.7 104.05,26.9 103.9,27.05 X50.4
A2_CTS
  Bottom 0.178: RN51.8 94.45,26.9 94,27.35 X51.5
A2_RXD
  Bottom 0.178: RN51.6 92.85,26.9 93,27.05 X51.3
A2_TXD
  Bottom 0.178: RN51.5 92.05,26.9 92.5,27.35 X51.2
A2_XCK
  Bottom 0.178: RN51.7 93.65,26.9 93.5,27.05 X51.4
A_LED_AUX1  (via drill 0.33)
  Top 0.178: LED2.C v73.75,1.5 | v100.25,6.8 102.4,8.95 102.9,8.95 103.5,9.55 103.5,10.05 107.15,13.7 119.6,13.7 120.05,13.25 IC3.67
  Bottom 0.178: v73.75,1.5 74.05,1.2 94,1.2 99.6,6.8 v100.25,6.8
A_LED_AUX2  (via drill 0.33)
  Top 0.178: LED4.C 77.65,1.5 v78.3,2.15 | v99.1,8.95 99.9,8.95 101.05,10.1 101.05,10.6 101.85,11.4 102.35,11.4 106.4,15.45 115.85,15.45 119.65,19.25 IC3.55
  Bottom 0.178: v78.3,2.15 78.55,1.9 93.7,1.9 99.1,7.3 v99.1,8.95
A_LED_AUX3  (via drill 0.33)
  Top 0.178: LED3.C 75.55,1.5 v75.85,1.8 | v99.7,7.4 100.35,7.4 102.25,9.3 102.75,9.3 103.15,9.7 103.15,10.2 107,14.05 119.75,14.05 120.05,13.75 IC3.66
  Bottom 0.178: v75.85,1.8 76.1,1.55 93.85,1.55 v99.7,7.4
CANH1
  Top 0.406: IC1.7 59.33,23.83 U$51.2 59.9,28.3 55.25,28.3 54.4,29.15 R2.1
CANH2
  Top 0.406: IC2.7 78.98,23.83 U$50.2 79.55,28.3 74.9,28.3 74.05,29.15 R4.1
CANL1
  Top 0.406: IC1.6 61.87,23.87 U$51.1 66.8,28.8 R3.2
CANL2
  Top 0.406: IC2.6 81.52,23.87 U$50.1 86.45,28.8 R5.2
CANRX1
  Top 0.178: IC3.14 137.05,15.75 139.75,13.05 139.75,4.4 136.55,1.2 84.25,1.2 78,7.45 62.15,7.45 59.33,10.27 IC1.2
CANRX2  (via drill 0.33)
  Top 0.178: IC3.54 119.65,19.75 115.7,15.8 106.25,15.8 102.2,11.75 101.7,11.75 101.2,11.25 91.9,11.25 90.2,9.55 v83.35,9.55 | v81.7,9.55 79.75,9.55 78.98,10.32 IC2.2
  Bottom 0.178: v81.7,9.55 v83.35,9.55
CANTX1
  Top 0.178: IC3.13 137.05,15.25 139.4,12.9 139.4,4.55 136.4,1.55 84.4,1.55 78.15,7.8 64.45,7.8 61.87,10.38 IC1.3
CANTX2
  Top 0.178: IC3.96 132.35,6.45 130.7,4.8 106.4,4.8 105.7,5.5 99,5.5 95.25,9.25 94.75,9.25 94.45,8.95 83.12,8.95 81.52,10.55 IC2.3
D1_CTS  (via drill 0.33)
  Top 0.178: IC3.1 136.6,9.25 136.8,9.05 136.8,5.75 135.5,4.45 106.25,4.45 105.55,5.15 104.85,5.15 v104.6,4.9
  Bottom 0.178: v104.6,4.9 104.55,4.95 104.55,16.45 104.7,16.6 IC50.3
D1_RXD  (via drill 0.33)
  Top 0.178: IC3.3 136.6,10.25 137.15,9.7 137.15,5.6 135.65,4.1 105.8,4.1 v105.35,4.55
  Bottom 0.178: v105.35,4.55 105.35,4.95 104.9,5.4 104.9,16.25 105.35,16.7 IC50.2
D1_TXD  (via drill 0.33)
  Top 0.178: IC3.4 136.6,10.75 137.5,9.85 137.5,5.45 135.8,3.75 104.55,3.75 v103.4,4.9
  Bottom 0.178: v103.4,4.9 103.4,5.05 103.85,5.5 103.85,16.25 103.4,16.7 IC50.5
D1_XCK  (via drill 0.33)
  Top 0.178: IC3.9 136.6,13.25 138.9,10.95 138.9,4.85 136.4,2.35 v103.25,2.35
  Bottom 0.178: IC50.4 104.05,16.6 104.2,16.45 104.2,5.35 104,5.15 104,4.65 103.25,3.9 v103.25,2.35
D2_CTS  (via drill 0.33)
  Top 0.178: IC3.8 136.6,12.75 138.55,10.8 138.55,5 136.25,2.7 103.8,2.7 102.05,4.45 98.2,4.45 95.2,7.45 v94.85,7.45
  Bottom 0.178: v94.85,7.45 94.15,8.15 94.15,16.45 94.3,16.6 IC51.3
D2_RXD  (via drill 0.33)
  Top 0.178: IC3.5 136.6,11.25 137.85,10 137.85,5.3 135.95,3.4 104.1,3.4 102.35,5.15 98.5,5.15 v95,8.65
  Bottom 0.178: v95,8.65 94.5,9.15 94.5,16.25 94.95,16.7 IC51.2
D2_TXD  (via drill 0.33)
  Top 0.178: IC3.6 136.6,11.75 138.2,10.15 138.2,5.15 136.1,3.05 103.95,3.05 102.2,4.8 98.35,4.8 95.1,8.05 v93.55,8.05
  Bottom 0.178: v93.55,8.05 93.45,8.15 93.45,9.95 92.95,10.45 92.95,10.85 93.45,11.35 93.45,16.25 93,16.7 IC51.5
D2_XCK  (via drill 0.33)
  Top 0.178: IC3.56 119.65,18.75 116,15.1 106.55,15.1 102.5,11.05 102,11.05 101.4,10.45 101.4,9.95 99.8,8.35 98.15,8.35 95.85,10.65 v93.55,10.65
  Bottom 0.178: v93.55,10.65 93.8,10.9 93.8,16.45 93.65,16.6 IC51.4
DBG_RX  (via drill 0.33)
  Top 0.178: IC3.70 120.05,11.75 118.8,13 107.45,13 104.2,9.75 104.2,9.25 103.2,8.25 102.7,8.25 101.2,6.75 101.2,6.4 100.65,5.85 99.15,5.85 95.4,9.6 94.55,9.6 94.25,9.3 91.3,9.3 v91.05,9.55
  Bottom 0.178: v91.05,9.55 89.08,7.58 JP50.3
DBG_TX  (via drill 0.33)
  Top 0.178: IC3.69 120.05,12.25 118.95,13.35 107.3,13.35 103.85,9.9 103.85,9.4 103.05,8.6 102.55,8.6 100.85,6.9 100.85,6.55 100.5,6.2 99.3,6.2 95.55,9.95 94.4,9.95 94.1,9.65 92.25,9.65 v92,9.9
  Bottom 0.178: v92,9.9 91.62,9.52 JP50.2
ECU_5V0
  pour Top (no thermals): 42.5,6.25 23.3,6.25 21.8,4.75 21.8,4.05 21.25,3.5 18.65,3.5 18.05,4.1 18.05,7.55 18.65,8.15 19.05,8.15 19.05,8.8 18.2,8.8 17.35,7.95 17.35,2.7 19.6,0.45 42.45,0.4
FWUP
  Top 0.254: R55.1 127.6,24.45 127.35,24.2 IC3.40
GND  (via drill 0.33, 0.38, 1.5)  (1 unrouted)
  Top 0.178: IC3.38 128.35,22.45 128.65,22.15 129.55,22.15 129.85,22.45 IC3.35
  Top 0.254: ML1.2 150.95,11.65 151.15,11.85 SW1.2 154.35,11.85 154.5,11.7 154.5,7.9 153.9,7.3 LED1.C SW2.2 153.3,6.15 | 153.3,6.15 151.15,6.15 150.95,5.95 ML2.2 | 153.3,6.15 153.3,5.65 152.1,4.45 143.85,4.45 v143.85,6.2 | IC3.73 121.25,10.25 v121.6,9.9 | IC3.12 135.55,14.75 v135.1,15.2 | 134.6,19.75 IC3.22
  Top 0.305: JP51.3 JP51.5 116.2,25.85 111.12,25.85 JP51.9
  Top 0.381: CN1.5 149.03,34.12 148.2,34.95 144.25,34.95 | v20.9,4.3 C16.1 | v19.1,4.3 R17.2
  Top 1.016: D4.A U$52.3
  Bottom 0.178: X51.1 92,29 94.5,29 X51.6
  Bottom 0.254: v135.1,15.2 134.55,15.75
  Bottom 0.305: C64.1 C73.1 | C63.1 C72.1
  other vias: 144,13.5 142.9,14.55 138.75,15.75 137.6,16.8 140.65,25.2 139.55,26.25 144.1,35 143,36.1 143,37.7 107.65,5.8 106,6.65 84.05,10.25 83.1,12.3 85,12.3 84.05,14.3 65.35,12.3 63.45,12.3 64.4,10.25 64.4,14.3 55.25,7.3 54.2,8.4 53.15,7.35 52.5,6.95 51.4,8 48.75,4.65 28.85,9.65 28.05,9.65 27.25,9.65 26.45,9.65 25.65,9.65 24.85,9.65 24.05,9.65 21.85,11 21.85,10.1 20.8,10.55 19.75,11 19.75,10.1 20,13.65 19.2,13.65 20.8,13.65 129.1,22.05
  pour Top (isolate 0.254, rank 3): 144.8,0 43.3,0 43.3,38.85 52.4,38.85 52.4,16.75 88.45,16.75 88.45,38.85 144.8,38.85
  pour Bottom (isolate 0.254, rank 2): 10.1,38.85 10.1,0 144.8,0 144.8,38.85 88.45,38.85 88.45,16.75 52.4,16.75 52.4,38.85
  pour Top (no thermals): 23.4,12.1 22.75,11.45 20.35,11.45 19.95,11.85 19.1,11.85 19.1,12.35 21.05,12.35 21.05,13.9 18.95,13.9 18.95,9.25 21.05,9.25 21.05,7.85 22.95,7.85 23.45,7.4 30.15,7.4 30.15,12.1
GND_CAN1
  pour Top (isolate 0.254): 53,36.15 68.2,36.25 68.2,17.35 53,17.35
  pour Bottom (isolate 0.254): 53,36.15 68.2,36.2 68.2,17.35 53,17.35
GND_CAN2
  pour Top (isolate 0.254): 72.65,36.65 87.85,36.65 87.85,17.35 72.65,17.35
  pour Bottom (isolate 0.254): 72.65,36.65 87.85,36.65 87.85,17.35 72.65,17.35
GNDPWER  (via drill 0.33)
  Top 0.381: D3.1 147.35,25.1 147.35,25.85 CN1.GND@2 | D2.1 145.75,28.25 145.75,28.8 CN1.GND@3 | D1.1 145.8,33.15 145.8,33.2 CN1.GND@4
  other vias: 146.95,37.7 148.55,35.85 149.35,36.45 150.15,35.85 152.75,36.45 153.55,35.85 153.55,26.15 152.75,25.55 150.15,26.15 149.35,25.55 148.55,26.15 146.85,28.8 147.45,29.6 147.45,28 146.85,33.2 147.45,32.4 147.45,34 146.95,36.1
  pour Top: 145.2,38.2 157.25,38.2 157.25,22.45 145.2,22.45
  pour Bottom: 145.2,22.45 153.95,22.45 154,38.2 145.2,38.2
JTAG_TCK  (via drill 0.33)  (1 unrouted)
  Top 0.178: JP51.4 R8.2 | IC3.18 135.45,17.75 135,18.2 124.3,18.2 122.6,19.9 122.6,20.35
  Bottom 0.178: JP51.4 117.58,28.45 112.8,28.45 112.4,28.05 112.4,24.4 113.2,23.6 119.55,23.6 v119.9,23.25
JTAG_TDI  (via drill 0.33)
  Top 0.178: JP51.8 R7.2 | IC3.19 135.45,18.25 135.15,18.55 124.45,18.55 123,20 v123,20.8
  Bottom 0.178: JP51.8 115.05,25.9 119.25,25.9 119.8,25.35 119.8,24.2 120.65,23.35 121.55,23.35 123,21.9 v123,20.8
JTAG_TDO  (via drill 0.33)
  Top 0.178: IC3.20 135.45,18.75 135.3,18.9 124.6,18.9 123.6,19.9 v123.6,20.25
  Bottom 0.178: JP51.6 117.24,26.25 119.4,26.25 120.2,25.45 120.2,24.3 120.8,23.7 121.7,23.7 123.6,21.8 v123.6,20.25
JTAG_TMS  (via drill 0.33)
  Top 0.178: JP51.2 121.25,27.29 R9.2 | IC3.21 124.75,19.25 124.2,19.8 v124.2,20.8
  Bottom 0.178: v124.2,20.8 124.2,21.7 122.4,23.5 122.4,26.15 121.28,27.27 JP51.2
N$1
  Top 0.254: IC4.10 19.55,9.1 19.05,9.6 19.05,11.5 19.55,12 IC4.7
N$2
  Top 0.254: R16.2 LED1.A
N$3
  Top 0.305: IC3.32 131.35,23.75 131.8,24.2 R13.1
N$4
  Top 0.305: R10.1 132.3,25.93 arc45 132.36,25.79 132.59,25.56 arc-45 132.65,25.42 132.65,24.28 arc-45 132.59,24.14 132.36,23.91 arc-45 132.22,23.85 arc45 132.1,23.8 131.91,23.61 arc45 131.85,23.47 IC3.31
N$5
  Bottom 0.178: IC50.13 105.35,25.2 105.15,25.4 103.4,25.4 103.25,25.25 RN50.3
N$6
  Bottom 0.178: IC51.13 94.95,25.2 94.75,25.4 93,25.4 92.85,25.25 RN51.3
N$7
  Bottom 0.178: IC51.12 94.3,23.7 94.45,23.85 RN51.1
N$8
  Top 0.178: LED3.A R20.2
N$9
  Top 0.178: LED4.A R21.2
N$10
  Bottom 0.178: IC50.12 104.7,23.75 104.85,23.9 RN50.1
N$11
  Bottom 0.178: IC51.10 93,23.65 92.85,23.8 92.2,23.8 92.05,23.95 RN51.4
N$12
  Bottom 0.178: RN50.2 IC50.11
N$13
  pour Top (no thermals): 29.55,13.7 23,13.7 22.5,13.2 22.5,12.9 38.1,12.9 38.1,15.45 31.3,15.45
N$14
  Top 0.178: LED2.A R19.2
N$15
  Bottom 0.178: IC50.10 103.4,23.65 103.25,23.8 102.6,23.8 102.45,23.95 RN50.4
N$16
  Bottom 0.178: RN51.2 IC51.11
N$17
  Top 0.254: 20.05,7 R17.1 | C16.2 20.05,7 | 20.05,7 IC4.11
N$18
  Bottom 0.254: R56.2 129.1,16.75 C84.1
N$19
  Bottom 0.254: R52.2 133.15,16.75 C61.2
N$20
  Bottom 0.254: R54.2 125.05,16.75 C65.1
N$23
  Top 0.406: R4.2 79.9,30.6 | 79.9,30.6 80.3,30.6 | 80.6,30.6 R5.1 | C3.2 81.1,28.2 80.25,29.05 80.25,30.25 | 80.25,30.25 80.25,30.55 80.3,30.6 | 80.25,30.25 80.6,30.6 | 80.3,30.6 80.6,30.6 | 79.9,30.6 80.25,30.25
N$30
  Top 0.406: C2.2 61.45,28.2 60.6,29.05 60.6,30.25 | 60.6,30.6 60.6,30.25 | 60.95,30.6 R3.1 | R2.2 60.25,30.6 | 60.25,30.6 60.6,30.6 | 60.6,30.25 60.95,30.6 | 60.6,30.6 60.95,30.6 | 60.25,30.6 60.6,30.25
N$55  (via drill 0.33)
  Top 0.406: FB2.2 v54.6,23.05
  Bottom 0.406: IC53.1 C79.2 55.8,24.65 54.6,23.45 v54.6,23.05
N$90  (via drill 0.33)
  Top 0.406: FB1.2 v74.25,23.1
  Bottom 0.406: IC52.1 C77.2 75.45,24.65 74.25,23.45 v74.25,23.1
SPI_CLK
  Top 0.178: IC3.77 122.85,6.95 121.95,6.05 113.1,6.05 112.85,6.3 112.85,7.65 113.11,7.91 IC5.6
SPI_MISO
  Top 0.178: IC3.75 120.63,8.98 120.2,8.55 111.45,8.55 108.9,11.1 106.5,11.1 106.2,10.8 106.2,9.4 106.42,9.18 IC5.2
SPI_MOSI
  Top 0.178: IC3.76 122.33,6.93 121.8,6.4 115.8,6.4 115.56,6.64 IC5.5
SW1_IN  (via drill 0.33)
  Top 0.178: IC3.97 132.85,6.95 133.6,6.2 135.95,6.2 v136.2,5.95 | v140.35,5.95 141.05,5.25 v142.15,5.25
  Top 0.254: SW2.1 151.1,2.75 150.95,2.9 ML2.1 R22.2 C17.2 v143.8,3.6
  Bottom 0.178: v136.2,5.95 136.45,6.2 140.1,6.2 v140.35,5.95 | v142.15,5.25 v143.8,3.6
SW2_IN  (via drill 0.33)
  Top 0.178: IC3.98 133.35,6.95 133.75,6.55 135.95,6.55 v136.2,6.8 | v140.35,6.8 v142.15,6.8
  Top 0.254: 150.35,9.3 ML1.1 150.95,8.65 151.15,8.45 SW1.1 | C11.2 R15.2 149.85,9.3 | 150.1,9.3 149.85,9.3 | v144.55,9.2 144.55,9.5 146.9,11.85 149.9,11.85 150.1,11.65 150.1,9.55 | 150.1,9.55 150.1,9.3 | 150.1,9.55 150.35,9.3 | 150.1,9.3 150.35,9.3 | 150.1,9.55 149.85,9.3
  Bottom 0.178: v136.2,6.8 136.45,6.55 140.1,6.55 v140.35,6.8 | v142.15,6.8 v144.55,9.2
USB_5V0
  Top 0.406: L1.2 C10.1 142.9,7.6 | 142.9,7 142.9,4.65 138.95,0.7 48.85,0.7 47.55,2 JP1.1 46.34,3.76 45.6,4.5 R18.3 | 142.9,7 142.9,7.6 | 143.2,7.3 R16.1 | 142.9,7 143.2,7.3 | 142.9,7.6 143.2,7.3
USB_D+
  Top 0.305: 144,30.92 140.03,30.92 arc45 139.89,30.87 135.46,26.43 arc45 135.4,26.29 135.4,22.88 arc-45 135.34,22.74 134.91,22.31 arc-45 134.77,22.25 134.55,22.25 arc-90 134.35,22.45 IC3.26 134.35,25.42 arc45 134.29,25.56 134.06,25.79 arc-45 134,25.93 R10.2 | 144,30.92 148.09,30.92 arc45 148.23,30.98 arc-45 148.27,31 CN1.3 | 144,30.92 D1.2
USB_D-
  Top 0.305: CN1.2 148.33,30.35 arc-45 148.19,30.41 arc45 148.15,30.42 144,30.42 | 144,30.42 140.21,30.42 arc45 140.07,30.37 135.96,26.26 arc45 135.9,26.12 135.9,25.93 arc45 135.96,25.79 136.19,25.56 arc-45 136.25,25.42 136.25,25.33 arc-45 136.19,25.19 135.96,24.96 arc45 135.9,24.82 135.9,24.73 arc45 135.96,24.59 136.19,24.36 arc-45 136.25,24.22 136.25,24.13 arc-45 136.19,23.99 135.96,23.76 arc45 135.9,23.62 135.9,23.53 arc45 135.96,23.39 136.14,23.21 arc-45 136.2,23.07 136.2,23.03 arc-45 136.14,22.89 135.06,21.81 arc-45 134.92,21.75 134.38,21.75 arc-45 134.24,21.81 133.91,22.14 arc-45 133.85,22.28 IC3.27 133.85,23.77 arc45 133.79,23.91 133.56,24.14 arc-45 133.5,24.28 R13.2 | 144,30.42 D2.2
USB_ID  (via drill 0.33)  (1 unrouted)
  Top 0.178: CN1.4 145.8,31.65 145.15,32.3 140.6,32.3 138.65,30.35 v131.35,30.35 | IC3.94 131.35,8.25 v131.65,8.55
  Bottom 0.178: 131.35,21.3 v131.35,30.35
USB_VBUS
  Top 0.178: 142.62,26.23 142.4,26.45 | 142.4,26.45 142.4,26.1 142.75,26.45 142.4,26.45 | IC3.28 133.35,22.4 133.45,22.3 133.45,22 134.15,21.3 135.2,21.3 136.65,22.75 136.65,26.35 137.25,26.95 141.9,26.95 142.4,26.45
  Top 0.381: CN1.1 149.03,27.88 148.2,27.05 144.05,27.05 D3.2 | L1.1 C9.1
  Top 0.406: C9.1 141.2,14.2 142.2,15.2 142.2,25.8 142.62,26.23 143.2,26.8 D3.2 144.2,26.8
VBG  (2 unrouted)
VCC_3V3  (via drill 0.33)  (2 unrouted)
  Top 0.178: JP51.1 120,26.03 120,31 | IC5.7 115.98,9.18 116.15,9.35 116.15,10.05 115.75,10.45 IC5.8 | IC5.3 109.11,7.91 109.35,8.15 109.35,8.95 v109.45,9.05 | R21.1 R20.1 R19.1 71.9,6 71.35,5.45 v71.35,1.45
  Top 0.254: R15.1 C11.1 146.97,11 145.85,9.88 145.85,5.55 | R22.1 C17.1 146.1,5.3 | v144.6,5.3 145.6,5.3 | 145.6,5.3 145.85,5.3 | 145.85,5.3 145.85,5.55 | 145.6,5.3 145.85,5.55 | 145.85,5.3 146.1,5.3 | 145.85,5.55 146.1,5.3 | v123.35,11.95 v127.4,11.95
  Top 0.305: v112.7,10.45 IC5.8 | v112.7,10.45 | v112.7,10.45 v112.7,10.46 v112.7,12.35 | JP50.4 82.25,5.45 78.1,9.6 77.35,9.6 76.45,10.5 IC2.1
  Top 0.406: R9.1 120,31 R8.1 R7.1 R6.1 110.05,31 109.35,30.3 109.35,23 v114.25,18.1 113.35,17.2 v112.7,17.2 v108.5,17.2 v98.1,17.2 91.7,17.2 89.55,15.05 76.85,15.05 | C15.1 IC6A.5 v51.25,5.6 | C15.1 TP1.TP | IC2.1 76.45,12.28 v76.45,14.3 76.45,14.65 | IC1.1 | IC1.1 v56.8,14.3 57.55,15.05 76.05,15.05 | 76.05,15.05 76.45,15.05 | 76.45,15.05 76.45,14.65 | 76.45,14.65 76.85,15.05 | 76.45,15.05 76.85,15.05 | 76.05,15.05 76.45,14.65 | IC1.1 56.8,7.35 55.05,5.6 C15.1
  Bottom 0.178: C51.1 110.85,10.45 v109.45,9.05 109.8,8.7 R50.1 | 71.35,0.7 71.35,1.1 | 71.35,1.1 v71.35,1.45 | 71.35,1.1 71.65,0.8 71.05,0.8 71.35,1.1
  Bottom 0.254: R12.P$1 R11.P$1 | L52.1 C83.2 v127.4,11.95 | v123.35,11.95 C58.2 L51.1 R51.P$1
  Bottom 0.305: 97.15,17.23 IC51.1 | IC50.1 107.55,17.23 C63.2 | v112.7,10.45 C51.1 | v112.7,17.2 v112.7,12.35
  Bottom 0.406: 107.55,17.23 108.47,17.23 v108.5,17.2 | 97.15,17.23 C64.2 v98.1,17.2 | v56.8,14.3 C60.2 | v76.45,14.3 C59.2 | v144.6,5.3 144.6,1.7 143.6,0.7 71.35,0.7 52.85,0.7 50.9,2.65 50.9,5.25 v51.25,5.6
VCC_5V0  (via drill 0.33)
  Top 0.406: C12.1 IC6A.1 50.55,5.6 50.55,3.7 IC6A.3 | v106.45,24.2 v96.05,24.2 88.45,16.6 55.5,16.6 49.7,10.8 C12.1 | JP1.2 R18.1 43.8,6.25 44.5,6.95 C12.1
  Bottom 0.305: 97.15,23.08 C73.2 | 107.55,23.08 C72.2
  Bottom 0.406: IC51.14 97.15,23.08 C82.2 96.5,24.65 v96.05,24.2 | IC50.14 107.55,23.08 C81.2 106.9,24.65 v106.45,24.2
VCC_CAN1  (via drill 0.33)
  Top 0.406: IC1.8 56.79,21.9 v55.1,21.9
  Bottom 0.406: C78.2 IC53.3 62.9,23.85 60.95,21.9 v55.1,21.9 C67.2
VCC_CAN2  (via drill 0.33)
  Top 0.406: v74.75,21.9 76.44,21.9 IC2.8
  Bottom 0.406: C76.2 IC52.3 82.55,23.85 80.6,21.9 v74.75,21.9 C66.2
VDDANA  (via drill 0.33)
  Top 0.254: v119.75,21.25 IC3.51
  Bottom 0.254: C70.2 v119.75,21.25 122.4,18.6 R54.1 L51.2
VDDBU  (via drill 0.33)
  Top 0.254: IC3.39 v127.85,22.1 | R55.2 129.9,25.1 129.6,25.4 v129.05,25.4
  Bottom 0.254: v127.85,22.1 C69.2 R11.P$2 129.05,24 v129.05,25.4
VDDCORE  (via drill 0.33)
  Top 0.254: IC3.45 v124.85,22.1 124.85,21.45 | IC3.34 v130.35,22.1 129.7,21.45 126.5,21.45 | IC3.89 128.85,8.1 v128.4,8.55 | IC3.10 135.55,13.75 v135.1,13.3 135.1,9.75 131.45,9.75 | v121.6,11.7 121.15,11.25 IC3.71 | v121.6,11.7 122.6,11.7 124.55,9.75 v128.4,9.75 131.45,9.75 | 124.85,21.45 126.5,21.45 | 126.5,21.45 R14.P$2 | 124.85,21.45 121.6,21.45 v121.6,11.7 | 131.45,9.75 v131.45,11.9
  Bottom 0.254: v124.85,22.1 C75.1 | v130.35,22.1 C80.1 | C52.1 v128.4,8.55 v128.4,9.75 | v135.1,13.3 C57.1 | C54.1 v121.6,11.7 | L50.1 C62.2 v131.45,11.9
  pour Top: 135.5,13.8 134.8,13.8 133.1,12.1 123.15,12.1 122.3,12.95 122.3,21 122.6,21.3 128.4,21.3 128.55,21.45 128.55,21.5 128.45,21.6 121.6,21.6 121.3,21.3 121.3,10.95 122.65,10.95 124.15,9.5 135.1,9.5 135.5,9.9
VDDIN  (via drill 0.33)
  Top 0.254: IC3.43 v125.85,22.1
  Bottom 0.254: v125.85,22.1 R12.P$2 125.85,25.65 125.3,26.2 C4.1
VDDIO  (via drill 0.33)
  Top 0.254: v135.1,14.25 IC3.11 | IC3.90 129.35,8.1 v129.8,8.55 | IC3.72 v121.6,10.75 v122.4,10.75 124,9.15 129.2,9.15 v129.8,8.55 | v129.8,8.55 130.4,9.15 v134.5,9.15
  Bottom 0.254: 121.35,13.8 122.4,12.75 v122.4,10.75 | 121.35,13.8 C56.1 | 121.35,13.8 122.1,14.55 R51.P$2 | C55.1 135.55,14.7 v135.1,14.25 134.5,13.65 v134.5,9.15 | v129.8,8.55 C50.1 | C53.1 121.15,10.3 v121.6,10.75
VDDOUT  (via drill 0.33)
  Top 0.254: v126.75,25.65 126.35,25.25 IC3.42 126.35,22.45 126.5,22.3 R14.P$1
  Bottom 0.254: C5.2 127.35,26.25 v126.75,25.65
VDDPLL  (via drill 0.33)
  Top 0.254: IC3.23 v135.2,20.25 132,20.25 v131.45,19.7
  Bottom 0.254: v135.2,20.25 C68.2 | L50.2 R52.1 v131.45,19.7
VDDUTMI  (via drill 0.33)
  Top 0.254: IC3.30 v132.35,22.1 131.25,21 128.7,21 v127.4,19.7
  Bottom 0.254: v132.35,22.1 C74.2 | L52.2 R56.1 v127.4,19.7
VIN
  Top 0.254: IC4.3 21.55,14.3
  pour Top (no thermals): 21.55,13.75 21.55,19.05 25.05,22.55 25.05,27.45 25.35,27.75 29.3,27.75 29.6,27.45 29.6,15.05 29.15,14.6 22.4,14.6
XIN
  Top 0.178: IC3.24 139.9,20.75 140.45,20.2 X1.3 C7.1
XOUT
  Top 0.178: IC3.25 138.5,21.25 139.05,21.8 139.05,22.6 138.65,23 X1.1 C6.1

### Text on the board
Top: Toyotune USB 2.0 | Copyright 2015, Powertrain Logic LLP
bPlace: RX | TX | GND
tStop: Toyotune USB 2.0 | Copyright 2015, Powertrain Logic LLP